# Altium schematic sheet Display.SchDoc: Nixe display array
size A4; Author: L. Sartory; Organization: L. Sartory; Address2: Nixie clock; Address3: with GPS synchronization; DocumentNumber: 2; Revision: B1; SheetNumber: 2; SheetTotal: 12
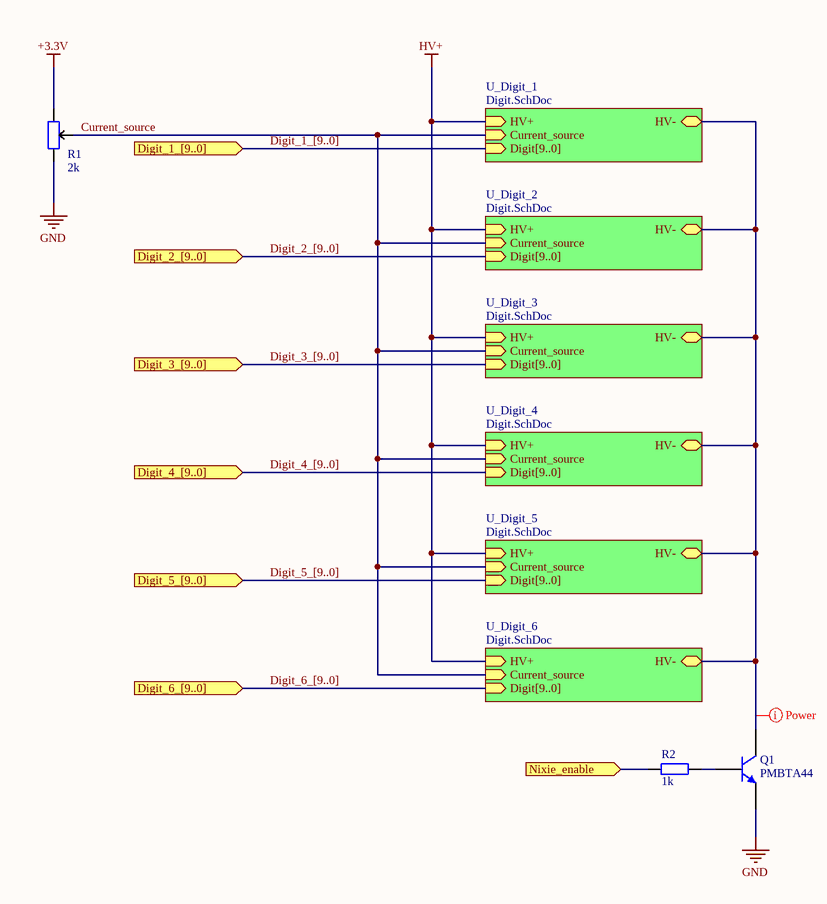
[diagram p0: Display.SchDoc]

## Parts
Q1  PMBTA44  [SOT23_PMBTA44]
R1  2k  [3314G-2-202E]
R2  1k  [RES0805]

## Sub-sheets
U_Digit_1 = Digit.SchDoc: HV+ (in), HV- (bidir), Current_source (in), Digit[9..0] (in)
U_Digit_2 = Digit.SchDoc: HV+ (in), HV- (bidir), Current_source (in), Digit[9..0] (in)
U_Digit_3 = Digit.SchDoc: HV+ (in), HV- (bidir), Current_source (in), Digit[9..0] (in)
U_Digit_4 = Digit.SchDoc: HV+ (in), HV- (bidir), Current_source (in), Digit[9..0] (in)
U_Digit_5 = Digit.SchDoc: HV+ (in), HV- (bidir), Current_source (in), Digit[9..0] (in)
U_Digit_6 = Digit.SchDoc: HV+ (in), HV- (bidir), Current_source (in), Digit[9..0] (in)

## Ports
Digit_1_[9..0] (in), Digit_2_[9..0] (in), Digit_3_[9..0] (in), Digit_4_[9..0] (in), Digit_5_[9..0] (in), Digit_6_[9..0] (in), Nixie_enable (in)

## Nets
+3.3V: R1.1
GND: Q1.2(E) R1.3
HV+: sheet U_Digit_1/HV+, sheet U_Digit_2/HV+, sheet U_Digit_3/HV+, sheet U_Digit_4/HV+, sheet U_Digit_5/HV+, sheet U_Digit_6/HV+
Current_source: R1.2 ; sheet U_Digit_1/Current_source, sheet U_Digit_2/Current_source, sheet U_Digit_3/Current_source, sheet U_Digit_4/Current_source, sheet U_Digit_5/Current_source, sheet U_Digit_6/Current_source
Nixie_enable: R2.1 ; port Nixie_enable
NetQ1_1: Q1.1(B) R2.2
NetQ1_3: Q1.3(C) ; sheet U_Digit_1/HV-, sheet U_Digit_2/HV-, sheet U_Digit_3/HV-, sheet U_Digit_4/HV-, sheet U_Digit_5/HV-, sheet U_Digit_6/HV-

## Buses and harness runs
bus Digit_1_[9..0] = port Digit_1_[9..0] = sheet U_Digit_1/Digit[9..0]
bus Digit_2_[9..0] = port Digit_2_[9..0] = sheet U_Digit_2/Digit[9..0]
bus Digit_3_[9..0] = port Digit_3_[9..0] = sheet U_Digit_3/Digit[9..0]
bus Digit_4_[9..0] = port Digit_4_[9..0] = sheet U_Digit_4/Digit[9..0]
bus Digit_5_[9..0] = port Digit_5_[9..0] = sheet U_Digit_5/Digit[9..0]
bus Digit_6_[9..0] = port Digit_6_[9..0] = sheet U_Digit_6/Digit[9..0]

## Layout directives
net class Power: NetQ1_3

## Notes on the sheet
- Title
- Size:
- Date:
- A4
- Number:
- Time:
- Revision:
- Sheet
- of
- File:
- (in symbol 1k 0805) Text
- (in symbol 3314G-2-202E) Text

## Library data of the parts
Q1 = PMBTA44: 400 V, 0.3 A NPN high-voltage low VCEsat transistor; HelpURL: http://assets.nexperia.com/documents/data-sheet/PMBTA44.pdf
R1 = 3314G-2-202E: Trimming potentiometer, 2k; Value: 2k
R2 = 1k 0805: Chip resistor 1k 0805; Value: 1k